# EasyEDA Pro project F405飞控工程文件（20250418）.epro, board 纯20x20
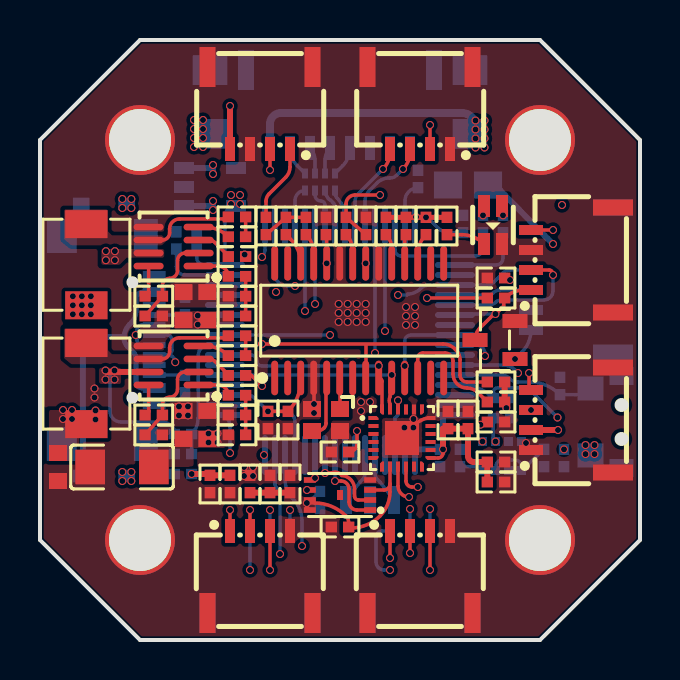
[diagram p3: board, top side]
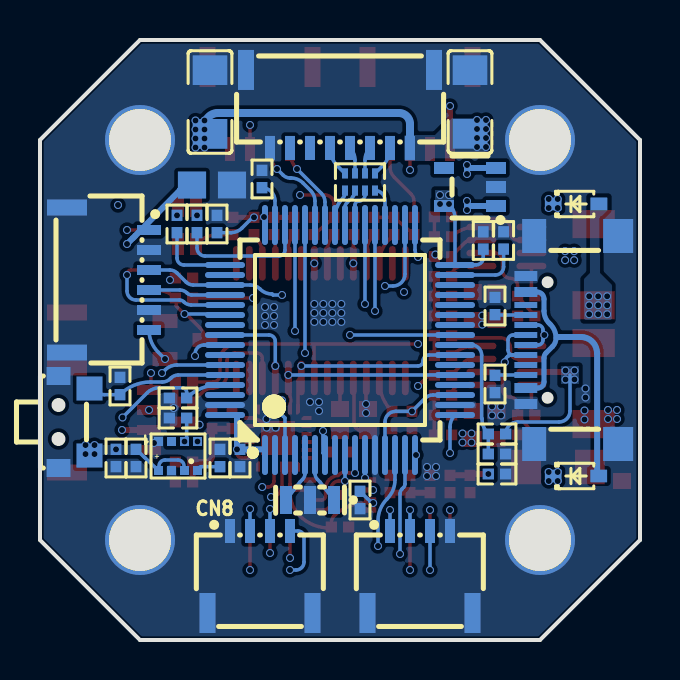
[diagram p4: board, bottom side, seen from below]

Outline 30 x 30 mm; copper layers: Top Layer, Inner1, Inner2, Bottom Layer. Coordinates in mm from the lower left corner of the outline.
Outline path: 0,5 0,25 5,30 25,30 30,25 30,5 25,0 5,0 0,5
Stack: Top Layer 0.035mm 外层铜厚1oz / Dielectric1 0.2104mm 7628 RC49% 8.6mil / Inner1 0.0152mm 内层铜厚 / Dielectric2 1.065mm 1.1mm H/HOZ Copper / Inner2 0.0152mm 内层铜厚 / Dielectric3 0.2104mm 7628 RC49% 8.6mil / Bottom Layer 0.035mm 外层铜厚1oz

## Design rules (mm)
template: 自定义配置
spacing copperThickness1oz (default): track to track 0.102, other pairs 0.152 to 0.3
spacing copperThickness2oz: track to track 0.203, other pairs 0.152 to 0.3
track width copperThickness1oz (default): min 0.127, default 0.175, max 2.54
track width copperThickness2oz: min 0.203, default 0.254, max 2.54
differential pair differentialPair (default): width min 0.127, default 0.254, max 2.54; gap min 0.152, default 0.152
via viaSize (default): diameter min 0.4, default 0.4, max 10; hole min 0.3, default 0.3, max 6.3

## Placement (name value [footprint] x y rotation side)
C1  100nF  [R0402]  21.15 20.8 90 bottom
C2  100nF  [R0402]  20 9.1 270 bottom
C3  100nF  [R0402]  7.84 19.98 90 bottom
C4  100nF  [R0402]  14 7 270 bottom
C5  100nF  [R0402]  21.4 11 90 top
C6  1uF  [R0402]  20.4 11 90 top
C7  100nF  [R0402]  22.8 18.1 0 top
C8  2.2uF  [R0402]  7.15 8.3 0 bottom
C11  100nF  [R0402]  15 9.4 180 top
C12  100nF  [C0402]  5.69 16.2 180 top
C13  100nF  [C0402]  5.69 10.26 180 top
C14  22uF  [C0603]  8.36 16.7 270 top
C15  22uF  [C0603]  7.17 16.7 270 top
C16  22uF  [C0603]  7.17 10.75 270 top
C18  47uF  [C1206]  21.5 26.9 270 bottom
C19  47uF  [C1206]  8.5 26.9 270 bottom
C20  100nF  [C0402]  9.85 20.16 0 top
C21  100nF  [C0402]  9.85 14.22 0 top
C22  2.2uF  [R0402]  6.82 19.98 90 bottom
C23  2.2uF  [R0402]  18.9 23.05 90 bottom
C25  47uF  [C1206]  4.1 8.65 0 top
C26  100nF  [C0402]  26.2 9.1 90 bottom
C27  100nF  [C0402]  25.2 9.1 90 bottom
C29  100nF  [C0402]  22.8 10.9 180 top
C30  4.7uF  [C0603]  0.9 8.65 270 top
C32  100nF  [C0402]  14.3 20.7 90 top
C33  100nF  [C0402]  11.4 11 270 top
C34  100nF  [C0402]  12.4 11 270 top
C35  22uF  [C0805]  21.4 22.75 0 bottom
C36  100nF  [C0402]  11.5 7.8 270 top
C37  10nF  [C0402]  12.5 7.8 270 top
C38  22uF  [C0402]  12.3 20.7 90 top
C39  22uF  [C0402]  13.3 20.7 90 top
C41  100nF  [C0402]  15.3 20.7 90 top
C42  22uF  [C0603]  8.36 10.75 270 top
C43  100nF  [R0402]  15 5.65 180 top
C44  100nF  [R0402]  8.5 7.8 270 top
C45  100nF  [R0402]  10.5 7.8 90 top
C46  100nF  [R0402]  9.5 7.8 270 top
C47  100nF  [R0402]  22.8 8.9 0 top
C48  100nF  [R0402]  22.8 7.9 0 top
CN1  HDGC1002WR-S-4P  [CONN-SMD_4P-P1.00_HDGC_HDGC1002WR-S-4P]  19 26.6 180 top
CN2  HDGC1002WR-S-4P  [CONN-SMD_4P-P1.00_HDGC_HDGC1002WR-S-4P]  11 26.6 180 top
CN3  HDGC1002WR-S-4P  [CONN-SMD_4P-P1.00_HDGC_HDGC1002WR-S-4P]  11 3.4 0 top
CN4  HDGC1002WR-S-4P  [CONN-SMD_4P-P1.00_HDGC_HDGC1002WR-S-4P]  26.6 11 90 top
CN6  HDGC1002WR-S-4P  [CONN-SMD_4P-P1.00_HDGC_HDGC1002WR-S-4P]  19 3.4 0 top
CN7  HDGC1002WR-S-4P  [CONN-SMD_4P-P1.00_HDGC_HDGC1002WR-S-4P]  26.6 19 90 top
CN8  HDGC1002WR-S-4P  [CONN-SMD_4P-P1.00_HDGC_HDGC1002WR-S-4P]  19 3.4 180 bottom
CN9  HDGC1002WR-S-6P  [CONN-SMD_6P-P1.00_HDGC1002WR-S-6P]  26.6 18 270 bottom
CN10  HDGC1002WR-S-4P  [CONN-SMD_4P-P1.00_HDGC_HDGC1002WR-S-4P]  11 3.4 180 bottom
D1  BAT60B  [SOD-323_L1.7-W1.3-LS2.6-RD-1]  3.2 21.8 180 bottom
D2  BAT60B  [SOD-323_L1.7-W1.3-LS2.6-RD-1]  3.2 8.2 180 bottom
L1  10uH  [IND-SMD_L4.4-W4.2]  2.32 18.76 90 top
L2  10uH  [IND-SMD_L4.4-W4.2]  2.32 12.82 90 top
LED1  TJ-S1615CY6TGLCCSRGB-A5  [LED-ARRAY-SMD_4P-L1.6-W1.5-BL-FD]  22.65 20.75 90 top
NOREF  -  [Pad_e186]  25 5 0 top
NOREF#2  -  [Pad_e183]  25 25 0 top
NOREF#3  -  [Pad_e187]  5 5 0 top
NOREF#4  -  [Pad_e188]  5 25 0 top
Q1  SS8050_C2150  [SOT-23-3_L2.9-W1.3-P1.90-LS2.4-BR]  22.75 15 0 top
R1  10kΩ  [R0402]  26 12.7 90 bottom
R2  10kΩ  [R0402]  7.15 10.3 180 bottom
R3  1kΩ  [R0402]  7.15 9.3 0 bottom
R4  100kΩ  [R0402]  5.69 17.19 180 top
R5  100kΩ  [R0402]  5.69 11.25 180 top
R6  10kΩ  [R0402]  22.8 17.1 0 top
R7  1MΩ  [R0402]  9.85 19.17 180 top
R8  1MΩ  [R0402]  9.85 13.23 180 top
R9  20Ω  [R0402]  9.85 21.15 0 top
R10  20Ω  [R0402]  9.85 15.21 0 top
R11  1kΩ  [R0402]  22.15 20.8 90 bottom
R12  10kΩ  [R0402]  23.1 12.1 180 bottom
R13  10kΩ  [R0402]  23.1 11.1 180 bottom
R14  1kΩ  [R0402]  23.15 20.8 90 bottom
R15  1kΩ  [R0402]  20.35 20.7 270 top
R16  51kΩ  [R0402]  9.85 18.18 0 top
R17  41.2kΩ  [R0402]  9.85 16.2 180 top
R18  51kΩ  [R0402]  9.85 12.24 0 top
R19  41.2kΩ  [R0402]  9.85 10.26 180 top
R20  7.68kΩ  [R0402]  9.85 17.19 0 top
R21  4.02kΩ  [R0402]  9.85 11.25 0 top
R22  100kΩ  [R0402]  21 9.1 270 bottom
R23  5.1kΩ  [R0402]  7.25 16.7 270 bottom
R24  5.1kΩ  [R0402]  7.25 12.8 90 bottom
R25  1k  [R0402]  22.8 11.9 0 top
R26  1k  [R0402]  18.3 20.7 90 top
R27  1k  [R0402]  19.3 20.7 90 top
R28  10k  [R0402]  17.3 20.7 90 top
R29  10k  [R0402]  22.8 12.9 0 top
R30  75  [R0402]  11.3 20.7 90 top
R34  75  [R0402]  16.3 20.7 90 top
RN2  47Ω  [RES-ARRAY-SMD_0402-8P-L2.0-W1.0-BL]  14 22.9 180 bottom
SW1  TS24CA  [SW-SMD_TS24CA]  28.3 10.9 90 bottom
U1  ME6217C33M5G  [SOT-23-5_L3.0-W1.7-P0.95-LS2.8-BR]  8.5 22.65 180 bottom
U2  MP9943GQ-Z  [QFN-8_L3.0-W3.0-P0.65-BL]  6.68 19.67 90 top
U3  MP9943GQ-Z  [QFN-8_L3.0-W3.0-P0.65-BL]  6.68 13.73 90 top
U4  AT7456E  [AT7456E-SHORTER-FOOTPRINT]  15.96 15.97 0 top
U5  MPU6500  [QFN-24_L3.0-W3.0-P0.40-BL-EP]  18.1 10.1 270 top
U6  SPL06-001  [SENSOR-SMD_SPL06-001]  23.1 9.2 0 bottom
U8  HDGC1002WR-S-8P  [CONN-SMD_8P-P1.00_HDGC_HDGC1002WR-S-8P]  15 26.55 0 bottom
U9  Crystal2016  [CRYSTAL2016]  14.3 11 0 top
U10  STM32F405RGT6  [LQFP-64_L10.0-W10.0-P0.50-LS12.0-BL]  15 15 180 bottom
U11  W25Q16JVUXIQ  [USON-8_L3.0-W2.0-P0.50-BL-EP]  15 7.25 90 top
USB1  TYPE-C 16P QTWT  [USB-TYPE-C-SMD_TYPE-C-16P-QTWT]  3.4 15 90 bottom
X1  8MHz  [OSC-SMD_3P-L3.2-W1.3-P1.20-L]  16.5 7 0 bottom

## Footprints (pads in the part's own frame, mm; a bottom-side part is the same pattern mirrored in y, then rotated)
AT7456E-SHORTER-FOOTPRINT
  oval 0.343x1.732 smd: 1(-4.225,-2.866) 2(-3.575,-2.866) 3(-2.925,-2.866) 4(-2.275,-2.866) 5(-1.625,-2.866) 6(-0.975,-2.866) 7(-0.325,-2.866) 8(0.325,-2.866) 9(0.975,-2.866) 10(1.625,-2.866) 11(2.275,-2.866) 12(2.925,-2.866) 13(3.575,-2.866) 14(4.225,-2.866) 15(4.225,2.865) 16(3.575,2.865) 17(2.925,2.865) 18(2.275,2.865) 19(1.625,2.865) 20(0.975,2.865) 21(0.325,2.865) 22(-0.325,2.865) 23(-0.975,2.865) 24(-1.625,2.865) 25(-2.275,2.865) 26(-2.925,2.865) 27(-3.575,2.865) 28(-4.225,2.865)
C0402
  rect 0.567x0.54 smd: 1(-0.432,0) 2(0.432,0)
C0603
  rect 0.8x0.9 smd: 1(-0.7,0) 2(0.7,0)
C0805
  rect 1.41x1.35 smd: 1(-1,0) 2(1,0)
C1206
  rect 1.485x1.728 smd: 1(-1.593,0) 2(1.593,0)
CONN-SMD_4P-P1.00_HDGC_HDGC1002WR-S-4P
  rect 0.5x1.2 smd: 1(-1.5,2.05) 2(-0.5,2.05) 3(0.5,2.05) 4(1.5,2.05)
  rect 0.8x2 smd: 5(2.625,-2.05) 6(-2.625,-2.05)
CONN-SMD_6P-P1.00_HDGC1002WR-S-6P
  rect 0.5x1.2 smd: 1(-2.5,2.05) 2(-1.5,2.05) 3(-0.5,2.05) 4(0.5,2.05) 5(1.5,2.05) 6(2.5,2.05)
  rect 0.8x2 smd: 7(3.625,-2.05) 8(-3.625,-2.05)
CONN-SMD_8P-P1.00_HDGC_HDGC1002WR-S-8P
  rect 0.5x1.2 smd: 1(-3.5,1.95) 2(-2.5,1.95) 3(-1.5,1.95) 4(-0.5,1.95) 5(0.5,1.95) 6(1.5,1.95) 7(2.5,1.95) 8(3.5,1.95)
  rect 0.8x2 smd: 9(4.7,-1.95) 10(-4.7,-1.95)
CRYSTAL2016
  custom 0.9x0.8 smd: 1(0.7,0.55) 2(-0.7,0.55) 3(-0.7,-0.55) 4(0.7,-0.55)
IND-SMD_L4.4-W4.2
  rect 1.4x2.12 smd: 1(2.028,0) 2(-2.028,0)
LED-ARRAY-SMD_4P-L1.6-W1.5-BL-FD
  rect 1.1x0.6 smd: 1(-0.95,-0.45) 2(0.95,-0.45) 3(0.95,0.45) 4(-0.95,0.45)
LQFP-64_L10.0-W10.0-P0.50-LS12.0-BL
  oval 0.3x2 smd: 1(-3.75,-5.75) 2(-3.25,-5.75) 3(-2.75,-5.75) 4(-2.25,-5.75) 5(-1.75,-5.75) 6(-1.25,-5.75) 7(-0.75,-5.75) 8(-0.25,-5.75) 9(0.25,-5.75) 10(0.75,-5.75) 11(1.25,-5.75) 12(1.75,-5.75) 13(2.25,-5.75) 14(2.75,-5.75) 15(3.25,-5.75) 16(3.75,-5.75) 33(3.75,5.75) 34(3.25,5.75) 35(2.75,5.75) 36(2.25,5.75) 37(1.75,5.75) 38(1.25,5.75) 39(0.75,5.75) 40(0.25,5.75) 41(-0.25,5.75) 42(-0.75,5.75) 43(-1.25,5.75) 44(-1.75,5.75) 45(-2.25,5.75) 46(-2.75,5.75) 47(-3.25,5.75) 48(-3.75,5.75)
  oval 2x0.3 smd: 17(5.75,-3.75) 18(5.75,-3.25) 19(5.75,-2.75) 20(5.75,-2.25) 21(5.75,-1.75) 22(5.75,-1.25) 23(5.75,-0.75) 24(5.75,-0.25) 25(5.75,0.25) 26(5.75,0.75) 27(5.75,1.25) 28(5.75,1.75) 29(5.75,2.25) 30(5.75,2.75) 31(5.75,3.25) 32(5.75,3.75) 49(-5.75,3.75) 50(-5.75,3.25) 51(-5.75,2.75) 52(-5.75,2.25) 53(-5.75,1.75) 54(-5.75,1.25) 55(-5.75,0.75) 56(-5.75,0.25) 57(-5.75,-0.25) 58(-5.75,-0.75) 59(-5.75,-1.25) 60(-5.75,-1.75) 61(-5.75,-2.25) 62(-5.75,-2.75) 63(-5.75,-3.25) 64(-5.75,-3.75)
OSC-SMD_3P-L3.2-W1.3-P1.20-L
  rect 0.6x1.4 smd: 1(-1.199,0) 2(0,0) 3(1.199,0)
Pad_e183
  round 3.5 hole 3.1: 1(0,0)
Pad_e186
  round 3.5 hole 3.1: 1(0,0)
Pad_e187
  round 3.5 hole 3.1: 1(0,0)
Pad_e188
  round 3.5 hole 3.1: 1(0,0)
QFN-8_L3.0-W3.0-P0.65-BL
  oval 0.33x1.5 smd: 1(-0.975,-1.25) 2(-0.325,-1.25) 3(0.325,-1.25) 4(0.975,-1.25) 5(0.975,1.25) 6(0.325,1.25) 7(-0.325,1.25) 8(-0.975,1.25)
QFN-24_L3.0-W3.0-P0.40-BL-EP
  custom 0.2x0.506 smd: 1(-1,-1.427) 6(1,-1.427) 13(1,1.427) 18(-1,1.427)
  rect 0.2x0.505 smd: 2(-0.6,-1.427) 3(-0.2,-1.427) 4(0.2,-1.427) 5(0.6,-1.427) 14(0.6,1.427) 15(0.2,1.427) 16(-0.2,1.427) 17(-0.6,1.427)
  custom 0.506x0.2 smd: 7(1.427,-1) 12(1.427,1) 19(-1.427,1) 24(-1.427,-1)
  rect 0.505x0.2 smd: 8(1.427,-0.6) 9(1.427,-0.2) 10(1.427,0.2) 11(1.427,0.6) 20(-1.427,0.6) 21(-1.427,0.2) 22(-1.427,-0.2) 23(-1.427,-0.6)
  rect 1.7x1.7 smd: 25(0,0)
R0402
  rect 0.566x0.54 smd: 1(-0.433,0) 2(0.433,0)
RES-ARRAY-SMD_0402-8P-L2.0-W1.0-BL
  rect 0.3x0.505 smd: 1(-0.75,0.427) 2(-0.25,0.427) 3(0.25,0.427) 4(0.75,0.427) 5(0.75,-0.427) 6(0.25,-0.427) 7(-0.25,-0.427) 8(-0.75,-0.427)
SENSOR-SMD_SPL06-001
  rect 0.45x0.45 smd: 1(0.975,-0.725) 2(0.325,-0.725) 3(-0.325,-0.725) 4(-0.975,-0.725) 5(-0.975,0.725) 6(-0.325,0.725) 7(0.325,0.725) 8(0.975,0.725)
SOD-323_L1.7-W1.3-LS2.6-RD-1
  rect 0.83x0.63 smd: 1(-1.14,0) 2(1.14,0)
SOT-23-3_L2.9-W1.3-P1.90-LS2.4-BR
  rect 1.25x0.7 smd: 1(1,-0.95) 2(1,0.95) 3(-1,0)
SOT-23-5_L3.0-W1.7-P0.95-LS2.8-BR
  rect 1x0.6 smd: 1(1.3,-0.95) 2(1.3,0) 3(1.3,0.95) 4(-1.3,0.95) 5(-1.3,-0.95)
SW-SMD_TS24CA
  rect 0.9x1.2 smd: 1(-2.3,0.775) 2(2.3,0.775)
  rect 1.2x1.3 smd: 3(-1.675,-0.775) 4(1.675,-0.775)
USB-TYPE-C-SMD_TYPE-C-16P-QTWT
  rect 1.7x1.5 smd: 0(-5.2,-2.309) 0(5.2,-2.309)
  rect 1.7x1.2 smd: 0(-5.2,1.891) 0(5.2,1.891)
  rect 0.5x1.14 smd: A1(-3.2,2.308) A4(-2.4,2.308) A9(2.4,2.308) A12(3.2,2.308)
  rect 0.3x1.14 smd: A5(-1.25,2.308) A6(-0.25,2.308) A7(0.25,2.308) A8(1.25,2.309) B5(1.75,2.308) B6(0.75,2.308) B7(-0.75,2.308) B8(-1.75,2.309)
USON-8_L3.0-W2.0-P0.50-BL-EP
  rect 0.28x0.6 smd: 1(-0.75,-1.508) 2(-0.25,-1.508) 3(0.25,-1.508) 4(0.75,-1.508) 5(0.75,1.508) 6(0.25,1.508) 7(-0.25,1.508) 8(-0.75,1.508)
  rect 0.5x0.3 smd: 9(0,0)

## Nets
As in the schematic, except:
GND: C1.2 C2.2 C3.2 C4.2 C5.2 C6.2 C7.1 C8.1 C11.2 C12.1 C13.1 C14.1 C15.1 C16.1 C18.1 C19.1 C22.2 C23.2 C25.1 C26.1 C27.1 C29.1 C30.2 C32.2 C33.2 C34.2 C35.1 C36.1 C37.1 C42.1 C43.2 C44.2 C45.2 C46.2 C47.2 C48.2 CN1.1 CN1.5 CN1.6 CN2.3 CN2.5 CN2.6 CN3.4 CN3.5 CN3.6 CN4.1 CN4.5 CN4.6 CN6.4 CN6.5 CN6.6 CN7.3 CN7.5 CN7.6 CN8.1 CN8.5 CN8.6 CN9.2 CN9.5 CN9.7 CN9.8 CN10.4 CN10.5 CN10.6 LED1.1 NOREF.1 NOREF#2.1 NOREF#3.1 NOREF#4.1 Q1.2 R1.2 R3.1 R20.1 R21.1 R22.1 R23.1 R24.1 R34.2 SW1.1 SW1.2 U1.2 U2.5 U3.5 U4.4 U4.20 U4.23 U5.18 U5.20 U5.25 U6.1 U6.7 U8.8 U8.9 U8.10 U9.2 U9.4 U10.12 U10.18 U10.63 U11.4 USB1.0 USB1.A1 USB1.A12 X1.2

Pads without a net: U1 4; U4 1 2 7 13 14 15 16 27 28; U5 1 2 3 4 5 6 7 11 14 15 16 17 19 21; U6 2; U8 6 7; U10 2 4 8 28; U11 9; USB1 A5 B5

## Via types
v1: diameter 0.4, hole 0.3, Top Layer to Bottom Layer, 178 vias

## Routing (per net, layer and track width the routed paths; a pad name or vN(x,y) marks a point on that pad's centre or on a via; arc(x,y) is an arc through that point)
4V5: length 16.9
  Top Layer w0.175: CN7.4 v1(25.65,20.5) ; CN3.3 v1(11.5,3.5) ; CN6.3 v1(19.5,3.5) ; CN1.2 v1(19.5,25.75)
  Top Layer w0.3: v1(7.58,8.3) 8.24,8.3 arc(8.33,8.28) 8.4,8.23 9.4,8.23
  Bottom Layer w0.175: CN8.4 17.1,5.45 arc(16.89,5.36) 16.8,5.15 16.8,3.9 arc(16.92,3.62) 17.2,3.5 v1(17.5,3.5) ; CN10.3 v1(10.5,3.5)
  Bottom Layer w0.3: v1(8.65,21.95) 8.65,21.72 ; 8.65,21.72 v1(8.65,21.5) ; 8.65,21.72 arc(8.62,21.71) 8.59,21.7 U1.1 ; U1.3 8.49,23.6 arc(8.58,23.58) 8.65,23.53 ; v1(8.65,23.75) 8.65,23.53 ; 8.65,23.53 v1(8.65,23.3)
  vias: v1(4.12,22.05) v1(4.12,21.6) v1(4.12,8.4) v1(4.12,7.95) v1(4.56,22.05) v1(4.56,21.6) v1(4.56,8.4) v1(4.56,7.95) v1(23.5,18)
5V_BEC: length 6.8
  Inner1 w0.5: v1(1.64,16.74) v1(2.09,16.74) v1(2.54,16.74) 6.92,16.74 arc(7.44,16.59) 7.8,16.18 arc(7.86,15.98) v1(7.89,15.77)
  vias: v1(1.64,17.19) v1(1.64,16.29) v1(2.09,17.19) v1(2.09,16.29) v1(2.54,17.19) v1(2.54,16.29) v1(7.89,16.22)
5V_USB: length 15.4
  Bottom Layer w0.25: USB1.A9 5.15,17.4 arc(4.9,17.3) 4.8,17.05 4.8,16.45 arc(4.74,16.13) 4.55,15.85 4.48,15.78 arc(4.27,15.47) 4.2,15.1 arc(4.25,14.87) 4.38,14.67 4.7,14.35 arc(4.77,14.24) 4.8,14.11 4.8,12.9 arc(4.89,12.69) 5.1,12.6 USB1.A4
  Bottom Layer w0.3: 4.15,15.15 2.95,15.15 arc(2.38,14.92) 2.15,14.35 2.14,14.34 2.14,8.3 2.15,8.29 arc(2.12,8.23) D2.2
9V_BEC: length 87.3
  Top Layer w0.3: v1(25.9,10.5) CN4.2 ; v1(9.5,26.7) CN2.4
  Inner1 w0.3: v1(25.9,10.5) 27.75,10.5 arc(28.14,10.34) 28.3,9.95 ; 1.6,11.35 3.16,11.35 arc(3.75,11.23) 4.25,10.9 4.54,10.61 arc(5.05,10.27) 5.65,10.15 8.81,10.15 arc(8.85,10.16) 8.88,10.17 ; 8.65,9.95 8.81,9.95 arc(8.85,9.96) 8.88,9.97 ; 8.65,9.95 5.65,9.95 arc(4.86,10.11) 4.2,10.55 3.8,10.95 arc(3.58,11.1) 3.32,11.15 1.6,11.15 ; 8.65,9.95 8.65,10.1 ; 8.65,9.95 8.65,6.7 arc(8.9,6.1) 9.5,5.85 21.1,5.85 arc(22.07,6.04) 22.89,6.59 24.21,7.91 arc(25.03,8.46) 26,8.65 27.65,8.65 arc(28.11,8.84) 28.3,9.3 28.3,9.95 ; 28.3,9.95 28.3,16.1 arc(28.11,17.07) 27.56,17.89 v1(25.65,19.8) ; v1(9.5,26.7) 9.5,23.63 arc(9.45,23.37) 9.3,23.15 arc(8.75,22.78) 8.09,22.65 1.55,22.65 arc(0.81,22.34) 0.5,21.6 0.5,12.1 arc(0.75,11.5) 1.35,11.25 ; v1(1.15,11.05) v1(1.6,11.05) ; v1(1.15,11.5) v1(1.6,11.5)
  Bottom Layer w0.3: CN9.1 24.84,20.5 arc(24.94,20.48) 25.03,20.42 25.24,20.21 arc(25.3,20.15) 25.36,20.09 v1(25.65,19.8) ; 24.75,20.7 23,22.49 23,22.5 arc(22.72,22.69) C35.2
  vias: v1(2.78,11.47) v1(2.78,11.03) v1(8.43,10.33) v1(8.43,9.88) v1(8.88,10.33) v1(8.88,9.88)
GND: length 3.4
  Top Layer w0.175: U5.25 18.15,10.1 v1(18.67,10.62) ; U4.4 13.7,13.09 v1(13.7,11.8) ; 19.38,11.1 arc(19.2,11.05) 19.04,10.98 arc(18.83,10.83) 18.65,10.65 ; 13.69,11.75 arc(13.72,11.55) v1(13.7,11.35)
  vias: v1(2.72,12.58) v1(2.72,12.12) v1(6.95,11.68) v1(6.95,11.23) v1(7.4,11.68) v1(7.4,11.23) v1(10.2,8.65) v1(10.2,8.2) v1(10.65,8.65) v1(10.65,8.2) v1(14.93,16.8) v1(14.93,16.35) v1(14.93,15.9) v1(15.38,16.8) v1(15.38,16.35) v1(15.38,15.9) v1(15.83,16.8) v1(15.83,16.35) v1(15.83,15.9) v1(16.05,11.9) v1(16.05,11.45) v1(16.28,16.8) v1(16.28,16.35) v1(16.28,15.9) v1(16.5,11.9) v1(18.22,10.62) v1(18.3,16.65) v1(18.3,16.2) v1(18.3,15.75) v1(18.68,11.05) v1(18.75,16.65) v1(18.75,16.2) v1(18.75,15.75) v1(24.3,9.85)
VBAT: length 52.3
  Top Layer w0.175: v1(11.1,12.7) 10.57,13.23 R8.1
  Top Layer w0.3: 5.43,13.4 3.35,13.4 v1(3.28,13.47)
  Inner2 w0.4: v1(11.1,12.7) 10.55,13.25 3.5,13.25
  Inner2 w1: 3.5,13.4 3.5,19.2 3.57,19.27 ; v1(8.15,24.65) v1(8.15,25.1) v1(8.15,25.55) v1(8.15,26) v1(7.7,26) v1(7.7,25.55) v1(7.7,25.1) v1(7.7,24.65) 7.7,23.4 3.57,19.27 ; 3.57,19.27 v1(10.23,19.27)
  Bottom Layer w0.175: 3.5,13.25 3.5,11.45 arc(3.66,11.06) 4.05,10.9 6.12,10.9 arc(6.54,10.72) R2.2
  Bottom Layer w0.4: v1(21.78,25.08) 21.78,25.67 arc(21.76,25.82) 21.72,25.95 arc(21.47,26.24) 21.1,26.35 12.05,26.35 arc(11.66,26.19) 11.5,25.8 U8.1
  vias: v1(3.29,19.44) v1(3.29,18.99) v1(3.28,13.03) v1(3.74,19.44) v1(3.74,18.99) v1(3.72,13.47) v1(3.72,13.03) v1(21.78,25.97) v1(21.78,25.53) v1(21.78,24.62) v1(22.22,25.97) v1(22.22,25.53) v1(22.22,25.08) v1(22.22,24.62)
VDD_MCU: length 105.1
  Top Layer w0.175: v1(11.4,11.43) C34.1 arc(12.87,12.14) 13.03,12.96 U4.3 ; C43.1 15.43,5.88 arc(15.4,6.05) 15.3,6.2 arc(14.58,6.68) 13.73,6.85 v1(13.34,6.85) 13.34,6.65 U11.8 ; 17.5,7.8 U5.8 ; 17.5,7.8 17.5,7.41 arc(17.37,6.75) 17,6.2 arc(16.34,5.76) 15.55,5.6 15.43,5.6 ; 17.5,7.8 arc(17.41,7.59) 17.2,7.5 U11.3 ; v1(20.15,9.53) 20.15,9.35 arc(20.08,9.17) 19.9,9.1 U5.13 ; R6.1 v1(19.35,17.1) ; v1(14.34,18.83) 14.34,20.18 arc(14.33,20.23) C32.1
  Top Layer w0.25: 17.3,21.13 v1(19.3,21.13) 20.35,21.13
  Top Layer w0.3: C48.1 C47.1 21.7,8.9 arc(21.49,8.99) 21.4,9.2 C5.1 20.15,10.57 v1(20.15,9.53) ; R29.2 R25.2 ; 10.5,7.37 C36.2 C37.2
  Inner1 w0.175: v1(20.15,9.53) 21.45,9.53 ; v1(23.32,11.6) 23.32,9.25 ; v1(14.34,18.83) v1(16.28,18.83) 16.28,21.04 arc(16.32,21.12) 16.39,21.15 ; v1(19.35,17.1) 21.09,17.1 arc(21.12,17.11) 21.15,17.13
  Inner1 w0.4: 27.5,9.25 23.32,9.25
  Inner1 w0.5: 21.15,13.1 21.15,10.25 arc(21.44,9.54) 22.15,9.25 23.32,9.25 ; 21.15,13.1 21.15,20.35 arc(20.92,20.92) 20.35,21.15 v1(18.8,21.15) 11.65,21.15 arc(10.73,21.33) 9.94,21.86 v1(9.55,22.25) ; 21.15,13.1 arc(21,12.75) 20.65,12.6 12.57,12.6 arc(11.74,12.26) v1(11.4,11.43) 11.4,11.19 arc(11.52,10.6) 11.85,10.1 arc(12.15,9.66) 12.25,9.13 12.25,8.1 arc(12.34,7.64) 12.6,7.25 12.76,7.09 arc(13.03,6.91) v1(13.34,6.85)
  Bottom Layer w0.175: C4.1 13.64,7.07 arc(13.56,7.02) 13.51,6.94 13.47,6.9 arc(13.41,6.86) v1(13.34,6.85) ; 21.15,20.37 20.46,20.37 arc(20.16,20.43) 19.9,20.6 19.41,21.09 arc(19.36,21.12) v1(19.3,21.13) ; 7.84,19.54 7.84,19.12 arc(7.94,18.86) 8.19,18.76 9.24,18.76 arc(9.25,18.76) U10.32 9.25,21.08 arc(9.33,21.47) v1(9.55,21.8) ; U10.13 12.75,10.9 arc(12.59,11.28) 12.22,11.43 v1(11.4,11.43) 10.75,12.09 arc(10.56,12.21) 10.35,12.25 U10.19 ; C27.2 24.79,9.14 arc(24.77,9.13) 24.75,9.11 U6.8 ; 22.8,8.7 arc(22.89,8.91) 23.1,9 23.75,9 arc(23.96,8.91) 24.05,8.7
  Bottom Layer w0.3: U10.1 18.75,9.53 v1(20.15,9.53) 20.15,11.25 U10.64
  vias: v1(10,22.25) v1(10,21.8) v1(26.2,9.53) v1(27.28,9.75) v1(27.28,9.3) v1(27.72,9.75) v1(27.72,9.3)
BOOT: length 7.1
  Bottom Layer w0.175: U10.60 23.09,13.25 arc(23.28,13.21) 23.45,13.1 23.49,13.06 arc(23.67,12.94) 23.88,12.9 24.47,12.9 arc(25.3,12.74) R1.1 26.78,12.27 arc(27.18,12.35) SW1.4
CAM: length 24
  Top Layer w0.175: v1(24.45,13.35) 24.45,12.6 CN4.4 ; R34.1 C41.2 15.3,21.8 arc(15.43,22.12) 15.75,22.25 v1(17,22.25)
  Inner1 w0.175: v1(17,22.25) 25.6,22.25 arc(25.95,22.1) v1(26.1,21.75)
  Inner2 w0.175: v1(24.45,13.35) 25.55,13.35 arc(25.94,13.51) 26.1,13.9 v1(26.1,21.75)
FB_5V: length 1.8
  Top Layer w0.175: U2.1 8.9,18.7 arc(9.27,18.55) R16.1
FB_9V: length 1.8
  Top Layer w0.175: U3.1 8.9,12.75 arc(9.27,12.6) R18.1
I2C1_SCL: length 19.9
  Inner1 w0.175: v1(22.12,9.92) arc(22.36,10.26) 22.45,10.66 arc(22.46,10.76) 22.45,10.86 22.45,11.65 arc(22.57,11.93) 22.85,12.05 23.55,12.05 arc(23.83,11.93) 23.95,11.65 23.95,11.45 arc(24.08,11.13) 24.4,11 25.75,11 arc(25.84,11.04) v1(25.88,11.12)
  Inner2 w0.175: v1(18.5,6.55) 18.53,6.58 arc(19,6.89) 19.55,7 21.5,7 arc(21.78,7.12) 21.9,7.4 21.9,9.38 arc(21.96,9.68) v1(22.12,9.92)
  Bottom Layer w0.175: CN8.3 v1(18.5,6.55) ; v1(25.88,11.12) 24.65,12.35 arc(24.36,12.54) 24.02,12.61 22.9,12.61 arc(22.74,12.54) 22.67,12.38 R12.2 arc(21.95,12.58) 21.1,12.75 U10.61
I2C1_SDA: length 16.2
  Inner2 w0.175: v1(23.9,13.35) 23.9,10.2 arc(23.81,9.99) 23.6,9.9 22.8,9.9 arc(22.78,9.91) v1(22.78,9.92) 22.57,9.72 arc(22.33,9.37) 22.25,8.95 22.25,6.85 arc(22.16,6.64) 21.95,6.55 v1(19.5,6.55)
  Bottom Layer w0.175: CN8.2 v1(19.5,6.55) ; U10.59 23.15,13.75 arc(23.47,13.69) 23.74,13.5 v1(23.9,13.35) ; R13.2 22.67,10.03 arc(22.7,9.96) v1(22.78,9.92)
LC_5V: length 4.7
  Top Layer w0.175: U2.6 6.12,20 arc(6.37,20.1) 6.48,20.36 6.48,20.56 arc(6.63,20.91) 6.98,21.05 9.17,21.05 arc(9.3,21.08) R9.1
LC_9V: length 4.7
  Top Layer w0.175: 5.43,14.05 6.12,14.05 arc(6.37,14.16) 6.48,14.42 6.48,14.61 arc(6.63,14.96) 6.98,15.11 9.17,15.11 arc(9.3,15.14) R10.1
LED1: length 6.8
  Bottom Layer w0.175: U10.46 17.75,19.5 arc(17.84,19.29) 18.05,19.2 21.75,19.2 arc(22.03,19.32) 22.15,19.6 22.15,20.37
LED2: length 3.9
  Bottom Layer w0.175: U10.49 22.8,18.75 arc(23.05,18.85) 23.15,19.1 23.15,20.37
MCU_OSCI: length 2.6
  Bottom Layer w0.175: X1.3 17,7.9 16.88,8.02 arc(16.78,8.16) 16.75,8.33 U10.5
MCU_OSCO: length 2.6
  Bottom Layer w0.175: U10.6 16.25,8.33 arc(16.22,8.16) 16.12,8.02 16,7.9 X1.1
NRST: length 2.5
  Top Layer w0.175: v1(15.85,10.45) 15.85,9.82 arc(15.73,9.52) C11.1
  Bottom Layer w0.175: v1(15.85,10.45) 15.85,9.35 U10.7
OSD_HSYNC: length 1.5
  Top Layer w0.175: 18.24,18.83 18.24,20.11 arc(18.25,20.2) R26.1
OSD_LOS: length 6.2
  Top Layer w0.175: 18.88,13.1 18.88,14.08 arc(18.96,14.27) 19.15,14.35 20.25,14.35 arc(20.53,14.23) 20.65,13.95 20.65,13.3 arc(20.86,12.81) 21.35,12.6 arc(21.64,12.54) 21.89,12.38 R25.1
OSD_OSCI: length 3.2
  Top Layer w0.175: U9.3 13.84,10.45 arc(14.03,10.49) 14.2,10.6 arc(14.27,10.71) 14.3,10.84 14.3,13.02 arc(14.31,13.06) U4.5
OSD_OSCO: length 1.6
  Top Layer w0.175: U9.1 15,13.06 arc(15,13.08) U4.6
OSD_RST: length 1.5
  Top Layer w0.175: 17.59,18.83 17.59,19.58 arc(17.51,19.95) R28.1
OSD_SAG: length 1.5
  Top Layer w0.175: 13.69,18.83 13.69,19.34 arc(13.59,19.84) C39.1
OSD_VOUT: length 1.7
  Top Layer w0.175: C38.1 12.54,20.03 arc(12.91,19.48) 13.03,18.83
OSD_VSYNC: length 1.5
  Top Layer w0.175: 18.88,18.83 18.88,19.27 arc(18.99,19.81) R27.1
OTG_FS_DM: length 19.7
  Inner1 w0.175: v1(6.76,13.89) 15.64,13.89 arc(16.24,14.01) v1(16.75,14.35)
  Bottom Layer w0.175: 6.35,14.25 USB1.B7 ; 6.35,14.25 6.4,14.25 arc(6.51,14.23) 6.6,14.19 arc(6.61,14.19) 6.61,14.18 arc(6.72,14.05) v1(6.76,13.89) ; 6.35,14.25 arc(6.53,14.32) 6.6,14.5 6.6,15 arc(6.53,15.18) 6.35,15.25 USB1.A7 ; v1(16.75,14.35) U10.44
OTG_FS_DP: length 21
  Inner1 w0.175: v1(4.79,15.25) 4.93,15.11 arc(5.6,14.66) 6.4,14.5 7.29,14.5 arc(7.48,14.46) 7.65,14.35 arc(7.82,14.24) 8.01,14.2 14.75,14.2 arc(15.86,14.42) 16.8,15.05 17.16,15.42 arc(17.2,15.44) v1(17.25,15.45)
  Bottom Layer w0.175: USB1.A6 5.1,14.75 arc(4.92,14.82) 4.85,15 4.85,15.5 arc(4.92,15.68) 5.1,15.75 USB1.B6 ; U10.45 v1(17.25,15.45)
PINIO2: length 6.4
  Inner1 w0.175: v1(24.55,11.5) 24.55,12.55 arc(24.45,12.8) 24.2,12.9 23.7,12.9 arc(23.42,13.02) 23.3,13.3 23.3,13.8 arc(23.18,14.08) 22.9,14.2 v1(22.25,14.2)
  Bottom Layer w0.175: v1(22.25,14.2) 22.25,14.3 arc(22.12,14.62) 21.8,14.75 U10.57
PWM_1: length 1.9
  Bottom Layer w0.175: RN2.8 14.75,22.34 arc(14.78,22.21) 14.85,22.1 arc(14.95,21.98) 15.04,21.86 arc(15.09,21.78) 15.12,21.7 arc(15.22,21.43) 15.25,21.13 U10.41
PWM_2: length 1.9
  Bottom Layer w0.175: U10.40 14.75,21.64 arc(14.73,21.76) 14.66,21.87 14.53,21.99 arc(14.43,22.05) 14.37,22.15 arc(14.28,22.29) 14.25,22.44 RN2.7
PWM_3: length 2
  Bottom Layer w0.175: RN2.6 13.75,22.25 arc(13.84,22.04) 14.05,21.95 arc(14.19,21.89) 14.25,21.75 U10.39
PWM_4: length 2
  Bottom Layer w0.175: U10.36 12.75,21.97 arc(12.9,22.33) RN2.5
SBUS: length 1.7
  Bottom Layer w0.175: v1(23.75,14.05) 24.09,14.39 arc(24.43,14.9) CN9.6
SDCARD_CS: length 4.2
  Top Layer w0.175: v1(14.75,7.95) 15.05,7.95 arc(15.33,7.83) 15.45,7.55 15.45,6.9 arc(15.57,6.62) 15.85,6.5 U11.1
  Bottom Layer w0.175: v1(14.75,7.95) U10.9
SENS_CUR1: length 5.2
  Bottom Layer w0.175: U10.25 v1(14.5,15.25)
SENS_VOL: length 6.7
  Bottom Layer w0.175: U10.24 8.42,14.75 arc(8.07,14.6) 7.92,14.24 7.92,11.08 7.9,11.07 arc(7.82,10.65) R2.1 R3.2
SPI1_IMU1_CS: length 3.2
  Top Layer w0.175: U5.22 v1(17.9,11.98)
  Bottom Layer w0.175: v1(17.9,11.98) 17.9,11.3 arc(17.89,11.25) 17.86,11.21 17.75,11.1 U10.3
SPI1_MISO: length 13
  Top Layer w0.175: U5.9 17.9,7.7 arc(18.06,7.31) v1(18.45,7.15)
  Inner2 w0.175: v1(18.45,7.15) 18.45,8.98 arc(18.35,9.51) 18.05,9.95 17.82,10.18 arc(17.4,10.81) 17.25,11.55 arc(17.36,12.1) 17.67,12.57 18,12.9 arc(18.17,13.16) 18.24,13.47 v1(18.24,13.7)
  Bottom Layer w0.175: U10.56 18.55,15.25 arc(18.33,15.16) 18.24,14.94 v1(18.24,13.7)
SPI1_MOSI: length 9.7
  Top Layer w0.175: U5.24 17.1,12.94 arc(17.05,13.05) U4.9
  Bottom Layer w0.175: U10.23 10.55,14.25 arc(10.76,14.16) 10.85,13.95 arc(10.92,13.77) 11.1,13.7 v1(16.94,13.7)
SPI1_OSD_CS: length 20.3
  Top Layer w0.175: 16.3,13.1 16.3,13.12 ; 16.3,13.12 16.3,14.77 ; 16.3,13.12 arc(16.3,13.11) U4.8 ; R29.1 21.35,12.9 arc(21.1,13) 21,13.25 21,14.02 arc(20.95,14.28) 20.8,14.5 20.75,14.55 arc(20.47,14.74) 20.15,14.8 v1(11.1,14.8)
  Inner2 w0.175: v1(11.1,19.15) v1(11.1,14.8)
  Bottom Layer w0.175: U10.33 11.25,19.51 arc(11.21,19.32) v1(11.1,19.15)
SPI1_SCLK: length 10
  Top Layer w0.175: U5.23 17.5,11.8 arc(17.46,11.98) 17.5,12.16 17.5,13.02 arc(17.52,13.08) U4.10
  Bottom Layer w0.175: v1(17.59,13.25) 9.25,13.25 arc(9.25,13.25) U10.21
SPI2_MISO: length 3.2
  Top Layer w0.175: U11.2 15.92,7 arc(15.78,7.06) 15.73,7.19 15.73,7.55 arc(15.54,8.01) 15.09,8.23 arc(14.85,8.38) 14.57,8.35 v1(14.25,8.35)
SPI2_MOSI: length 1.2
  Bottom Layer w0.175: v1(13.75,8.1) U10.11
SPI2_SCLK: length 15.7
  Top Layer w0.175: U11.6 v1(13.35,7.5)
  Inner2 w0.175: v1(13.35,7.5) 13.15,7.7 13.15,14.45 arc(13.21,14.77) 13.4,15.05 13.8,15.45 arc(14.13,15.95) 14.25,16.54 14.25,16.9 arc(14.04,17.39) 13.55,17.6 13.45,17.7 v1(12.75,17.7)
  Bottom Layer w0.175: v1(12.75,17.7) 12.35,17.7 arc(11.93,17.88) 11.75,18.3 U10.34
UART1_RX: length 4.9
  Top Layer w0.175: CN1.3 18.5,24.4 arc(18.41,23.94) v1(18.15,23.55)
  Bottom Layer w0.175: U10.43 16.25,21.95 arc(16.31,22.23) 16.46,22.46 16.85,22.85 arc(17.13,23.04) 17.45,23.1 17.5,23.1 arc(17.68,23.14) 17.84,23.24 v1(18.15,23.55)
UART1_TX: length 4.4
  Top Layer w0.175: CN1.4 17.5,24.4 arc(17.41,23.94) v1(17.15,23.55)
  Bottom Layer w0.175: v1(17.15,23.55) 15.93,22.33 arc(15.8,22.13) 15.75,21.9 U10.42
UART2_RX: length 5.9
  Top Layer w0.175: CN3.1 v1(9.5,6.5)
  Inner2 w0.175: v1(9.5,6.5) v1(9.5,9.35)
  Bottom Layer w0.175: v1(9.5,9.35) 9.5,10.65 arc(9.44,10.97) U10.17
UART2_TX: length 4
  Top Layer w0.175: CN3.2 v1(10.5,6.5)
  Inner2 w0.175: v1(11.2,9.25) 11.2,8.19 arc(11.02,7.28) v1(10.5,6.5)
  Bottom Layer w0.175: v1(11.2,9.25) U10.16
UART3_RX: length 3.9
  Bottom Layer w0.175: U10.52 22.41,17.25 arc(22.54,17.28) 22.65,17.35 arc(22.82,17.46) 23.01,17.5 CN9.4
UART3_TX: length 20.4
  Top Layer w0.175: v1(11.5,23.5) CN2.2
  Inner1 w0.175: v1(17.9,17.25) 12.16,17.25 arc(11.97,17.29) v1(11.8,17.4)
  Inner2 w0.175: v1(11.5,23.5) 11.5,19.33 arc(11.54,19.15) 11.5,18.97 11.5,18.17 arc(11.58,17.76) v1(11.8,17.4)
  Bottom Layer w0.175: CN9.3 23.51,18.5 arc(23.32,18.46) 23.15,18.35 22.7,17.9 arc(22.53,17.79) 22.34,17.75 U10.51 19.48,17.75 arc(19.22,17.7) 19,17.55 arc(18.72,17.36) 18.4,17.3 18.35,17.25 v1(17.9,17.25)
UART4_RX: length 11.9
  Top Layer w0.175: CN6.1 v1(17.5,4.1)
  Inner1 w0.175: v1(17.5,4.1) 12.48,4.1 arc(12.22,4.15) v1(12,4.3)
  Bottom Layer w0.175: U10.15 11.75,7.81 arc(11.77,7.71) 11.82,7.62 11.9,7.55 arc(11.97,7.44) 12,7.31 v1(12,4.3)
UART4_TX: length 11.4
  Top Layer w0.175: CN6.2 v1(18.5,4.35)
  Inner1 w0.175: v1(18.5,4.35) arc(18.28,4.5) 18.02,4.55 13.46,4.55 arc(13.27,4.59) v1(13.1,4.7)
  Bottom Layer w0.175: v1(13.1,4.7) 13.1,5.96 arc(12.98,6.55) 12.65,7.05 arc(12.35,7.49) 12.25,8.02 U10.14
UART5_RX: length 6.2
  Top Layer w0.175: CN7.1 24.2,17.5 arc(23.68,17.4) R6.2 arc(23.22,17.04) 23.19,16.99 23.19,16.7 22.79,16.3 v1(22.77,16.3) 22.7,16.3 22,15.6 arc(21.81,15.33) Q1.3
  Bottom Layer w0.175: v1(22.77,16.3) 20.8,16.3 U10.54
UART5_TX: length 7.3
  Top Layer w0.175: CN7.2 25.45,18.5 arc(25.59,18.44) 25.65,18.3 v1(25.65,18.25)
  Bottom Layer w0.175: U10.53 22.44,16.75 arc(22.63,16.79) 22.8,16.9 arc(22.91,16.97) 23.04,17 25.2,17 arc(25.52,17.13) 25.65,17.45 v1(25.65,18.25)
UART6_RX: length 17.1
  Inner2 w0.175: 12.2,8.51 12.2,14.73 arc(12.3,15.26) 12.6,15.7 arc(12.75,15.92) 12.8,16.18 12.8,16.8 arc(12.93,17.12) 13.25,17.25 13.35,17.25 arc(13.64,17.1) 13.75,16.8 ; 12.2,8.5 12.2,8.19 arc(12.02,7.28) v1(11.5,6.5)
  Bottom Layer w0.175: v1(13.75,16.8) 13.75,20.75 U10.38 ; CN10.2 v1(11.5,6.5)
UART6_TX: length 15.5
  Inner2 w0.175: v1(12.5,6.5) 12.5,14.48 arc(12.58,14.87) 12.8,15.2 arc(13.13,15.7) 13.25,16.29 v1(13.25,16.45)
  Bottom Layer w0.175: CN10.1 v1(12.5,6.5) ; U10.37 v1(13.25,16.45)
VCAP1: length 3.5
  Bottom Layer w0.175: 9.25,18.25 7.23,18.25 arc(6.94,18.37) 6.82,18.66 6.82,19.54
VCAP2: length 2.2
  Bottom Layer w0.175: U10.47 18.25,21.96 arc(18.44,22.42) 18.9,22.61
VIDIN: length 1.5
  Top Layer w0.175: 15.63,18.83 15.63,19.46 arc(15.55,19.9) C41.1
VTX: length 3.9
  Top Layer w0.175: 11.3,21.13 11.3,21.94 arc(11.34,22.13) 11.45,22.3 12.29,23.14 arc(12.44,23.37) 12.5,23.65 CN2.1
$1N953: length 2
  Top Layer w0.175: R15.2 21.07,20.27 arc(21.68,20.15) LED1.4
$1N1962: length 2.3
  Top Layer w0.175: R30.1 C38.2 C39.2
$1N3098: length 7.2
  Top Layer w0.175: U5.10 18.3,7.95 arc(18.39,7.74) 18.6,7.65 v1(18.89,7.65)
  Inner2 w0.175: v1(18.89,7.65) 21.15,7.65 arc(21.43,7.77) 21.55,8.05 21.55,9.62 arc(21.67,10.24) v1(22.02,10.76)
$1N3690: length 1.2
  Bottom Layer w0.175: 21,8.67 21.93,8.67 arc(22.07,8.61) U6.5
$1N5313: length 1.6
  Top Layer w0.175: U3.8 5.43,11.42 arc(5.38,11.3) R5.2
$1N5318: length 2
  Top Layer w0.175: R18.2 R21.2 R19.1
$1N5320: length 1.8
  Top Layer w0.175: 7.93,14.05 8.44,14.05 arc(8.61,14.02) 8.76,13.92 9.39,13.29 arc(9.41,13.26) R8.2
$1N5321: length 1.6
  Top Layer w0.175: 7.93,14.7 8.25,14.7 arc(8.88,14.58) C21.1
$1N5322: length 4.8
  Top Layer w0.175: 7.93,13.4 7.25,13.4 arc(6.99,13.29) 6.88,13.03 6.88,12.54 arc(6.76,12.26) 6.48,12.14 arc(6.23,12.03) 6.12,11.78 R5.1 C13.2
$1N5325: length 1
  Top Layer w0.175: C21.2 10.28,15.21 arc(10.28,15.21) R10.2
$1N5344: length 1.6
  Top Layer w0.175: U2.8 5.43,17.37 arc(5.38,17.24) R4.2
$1N5352: length 2
  Top Layer w0.175: R16.2 R20.2 R17.1
$1N5360: length 1.8
  Top Layer w0.175: U2.3 8.44,20 arc(8.61,19.96) 8.76,19.86 9.39,19.23 arc(9.41,19.2) R7.2
$1N5361: length 4.8
  Top Layer w0.175: 7.93,19.35 7.25,19.35 arc(6.99,19.24) 6.88,18.97 6.88,18.48 arc(6.76,18.2) 6.48,18.08 arc(6.23,17.98) 6.12,17.72 R4.1 C12.2
$1N5362: length 1.6
  Top Layer w0.175: 7.93,20.65 8.25,20.65 arc(8.88,20.52) C20.1
$1N5363: length 1
  Top Layer w0.175: C20.2 10.28,21.15 arc(10.28,21.15) R9.2
$1N5613: length 1.6
  Bottom Layer w0.175: USB1.A8 7.23,16.25 arc(7.24,16.25) R23.2
$1N5614: length 1.6
  Bottom Layer w0.175: USB1.B8 7.23,13.25 arc(7.25,13.25) R24.2
$1N20077: length 1.5
  Bottom Layer w0.175: RN2.4 12.87,23.71 arc(12.6,24.12) U8.2
$1N20079: length 1.3
  Bottom Layer w0.175: RN2.3 13.75,24 arc(13.69,24.33) U8.3
$1N20081: length 1.3
  Bottom Layer w0.175: RN2.2 14.25,24 arc(14.31,24.33) U8.4
$1N20083: length 1.5
  Bottom Layer w0.175: RN2.1 15.13,23.71 arc(15.4,24.12) U8.5
$1N22853:
  vias: v1(22.15,21.23)
$1N22855:
  vias: v1(23.15,21.23)

## Copper pours and planes (outline as drawn; the poured copper is in the pictures)
4V5 on Inner2: 0,0 30,0 30,30 0,30
5V_BEC on Top Layer: 6.7,16.45 9.7,16.45 9.7,15.55 6.7,15.55
5V_BEC on Bottom Layer: 1.4,16 1.4,17.75 2,18.35 2,21.1 1.6,21.5 1.6,22.15 2.5,22.15 2.5,18.35 2.8,18.05 2.8,16
5V_BEC on Inner1: 1.4,17.4 2.8,17.4 2.8,16.05 1.4,16.05
9V_BEC on Top Layer: 6.7,10.5 9.75,10.5 9.75,9.6 6.7,9.6
9V_BEC on Top Layer: 0.45,11.5 1.95,11.5 1.95,8.95 0.45,8.95
9V_BEC on Top Layer: 4.95,10.15 7.68,10.15 7.68,8.65 4.95,8.65
9V_BEC on Inner1: 0.9,11.75 3.05,11.75 3.05,10.75 0.9,10.75
GND on Top Layer: 5.13,12.24 10.28,12.24 10.28,10.25 5.13,10.25
GND on Top Layer: 5.13,18.18 10.28,18.18 10.28,16.2 5.13,16.2
GND on Top Layer: 0,0 30,0 30,30 0,30
GND on Bottom Layer: 0,0 30,0 30,30 0,30
GND on Inner1: 0,0 30,0 30,30 0,30
VBAT on Top Layer: 3.06,18.76 3.98,18.76 4.33,19.11 6.21,19.11 6.21,19.57 4.33,19.57 4.23,19.67 3.06,19.67
VBAT on Bottom Layer: 11.8,23.95 8.2,23.95 7.6,24.55 7.6,26.1 9.4,26.1 10.25,25.25 11.8,25.25
VDD_MCU on Top Layer: 12.2,7.65 13.8,7.65 13.8,6.35 12.2,6.35
VDD_MCU on Bottom Layer: 25.05,9.75 28.15,9.75 28.15,9.25 25.05,9.25
VDD_MCU on Bottom Layer: 23.05,12.51 24,12.51 24,10.7 23.05,10.7
LC_5V on Top Layer: 1.2,21.53 3.4,21.53 3.4,20.43 3.6,20.23 6.1,20.23 6.3,20.03 6.3,19.93 6.1,19.73 1.57,19.73 1.2,20.03
LC_9V on Top Layer: 1.2,15.59 3.4,15.59 3.4,14.49 3.6,14.29 6.1,14.29 6.3,14.09 6.3,13.99 6.1,13.79 1.57,13.79 1.2,14.09

Small or netless copper shapes (teardrops, artwork), in the pictures only: 1 on Top Layer, 2 on Bottom Layer, 3 on Inner1
